# EAGLE design plantSensor (EAGLE 6.4)
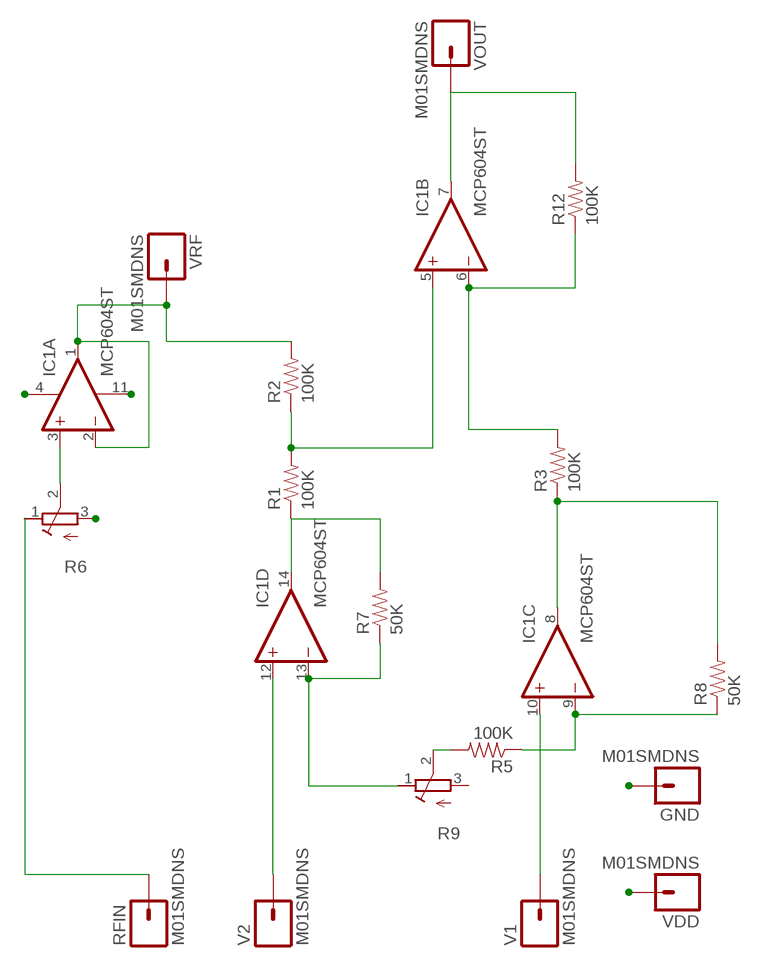
[diagram p0: schematic, sheet 1]

## Parts
GND  M01SMDNS  [1X01NS]
IC1  MCP604ST  [TSSOP14]
R1  100K  RESISTOR  [0805]
R2  100K  RESISTOR  [0805]
R3  100K  RESISTOR  [0805]
R5  100K  RESISTOR  [0805]
R6  R-TRIMM3314G  [RTRIM3314G]
R7  50K  RESISTOR  [0805]
R8  50K  RESISTOR  [0805]
R9  R-TRIMM3314G  [RTRIM3314G]
R12  100K  RESISTOR  [0805]
RFIN  M01SMDNS  [1X01NS]
V1  M01SMDNS  [1X01NS]
V2  M01SMDNS  [1X01NS]
VDD  M01SMDNS  [1X01NS]
VOUT  M01SMDNS  [1X01NS]
VRF  M01SMDNS  [1X01NS]

## Nets
GND: GND.1 IC1.11(P:V-) R6.3(A)
N$1: IC1.10(C:+IN) V1.1
N$2: R5.2 R9.2(S)
N$3: IC1.13(D:-IN) R7.1 R9.1(E)
N$4: IC1.12(D:+IN) V2.1
N$5: R6.1(E) RFIN.1
N$6: IC1.3(A:+IN) R6.2(S)
N$7: IC1.5(B:+IN) R1.2 R2.1
N$92: IC1.9(C:-IN) R5.1 R8.1
N$93: IC1.8(C:OUT) R3.1 R8.2
N$96: IC1.14(D:OUT) R1.1 R7.2
N$100: IC1.6(B:-IN) R3.2 R12.1
N$102: IC1.7(B:OUT) R12.2 VOUT.1
VDD: IC1.4(P:V+) VDD.1
VRF: IC1.1(A:OUT) IC1.2(A:-IN) R2.2 VRF.1
Unconnected: R9.3(A)

## Library data of the parts
GND RFIN V1 V2 VDD VOUT VRF = SparkFun-Connectors:M01: Header 1 Standard 1-pin 0.1" header. Use with straight break away headers (SKU : PRT-00116), right angle break away headers (PRT-00553), swiss pins (PRT-00743), machine pins (PRT-00117), and female headers (PRT-00115).
IC1 = linear:MCP604: Quad Op Amp 2.7V to 6.0V Single Supply CMOS Source: http://ww1.microchip.com/downloads/en/DeviceDoc/21314g.pdf
R1-R3 R5 R7 R8 R12 = SparkFun:RESISTOR: Resistor Basic schematic elements and footprints for 0603, 1206, and PTH 1/10th watt (small) resistors.
R6 R9 = rcl:R-TRIMM: Trimm resistor

## Board
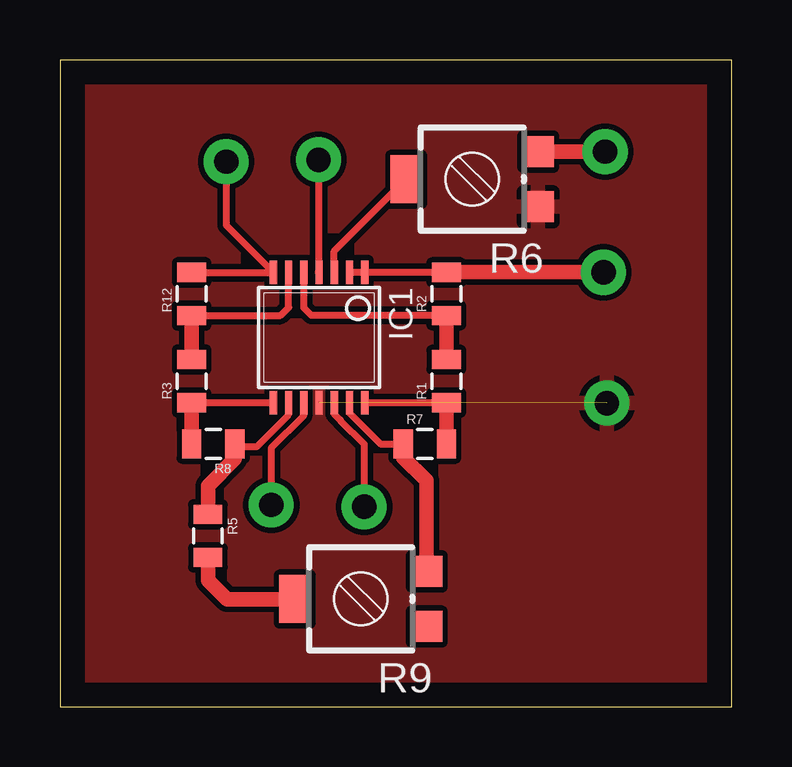
[diagram p1: board, top side]
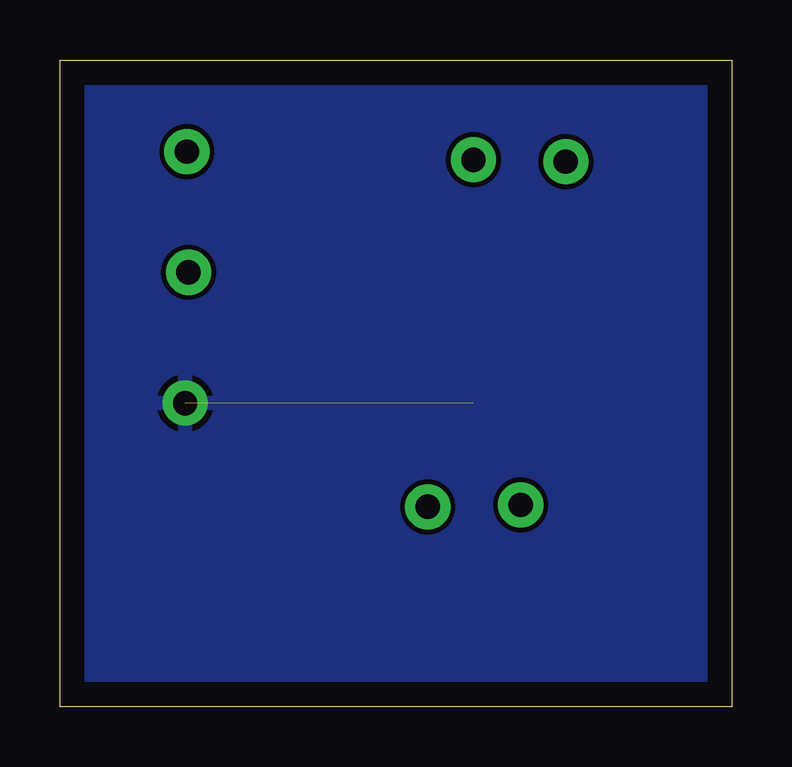
[diagram p2: board, bottom side, seen from below]

Size 28.02 x 26.97 mm. Coordinates in mm from the lower left corner, seen from the top.
Outline: 0,0 28.02,0.01 28.02,26.97 0.01,26.95 0,0
Copper layers (1*16): Top 0.035mm / dielectric 1.5mm / Bottom 0.035mm
Design rules "default": minimum track width 10mil, minimum drill 24mil, track to track 8mil, track to pad 8mil, pad to pad 8mil, via to via 8mil, smd to smd 8mil, copper to edge 40mil, drill to drill 8mil, minimum pad ring 10mil, minimum via ring 8mil, stop-mask expansion 4mil, vias tented up to drill 0mil, thermal gap 10mil

### Footprints (pad centres in the part's own frame; a part is rotated, then mirrored left to right if it is on the bottom)
1X01NS = drill 1.016 pad 1.88: 1 0,0
TSSOP14 = smd 0.305 x 0.991: 1 -1.905,-2.718; 2 -1.27,-2.718; 3 -0.635,-2.718; 4 0,-2.718; 5 0.635,-2.718; 6 1.27,-2.718; 7 1.905,-2.718; 8 1.905,2.718; 9 1.27,2.718; 10 0.635,2.718; 11 0,2.718; 12 -0.635,2.718; 13 -1.27,2.718; 14 -1.905,2.718
0805 = smd 0.8 x 1.2: 1 -0.9,0; 2 0.9,0
RTRIM3314G = smd 1.3 x 1.3: 1 1.15,-2.75; 3 -1.15,-2.75 | smd 2 x 1.3: 2 0,2.75

### Placement (x,y rotation side)
GND  22.8,12.65 0 top
IC1  10.8,15.4 180 top
R1  16.11,13.57 90 top
R2  16.11,17.22 90 top
R3  5.49,13.58 90 top
R5  6.17,7.12 270 top
R6  17.19,22 90 top
R7  15.21,10.96 0 top
R8  6.39,10.96 180 top
R9  12.54,4.49 90 top
R12  5.49,17.21 90 top
RFIN  22.73,23.14 0 top
V1  8.81,8.42 0 top
V2  12.69,8.33 0 top
VDD  10.78,22.8 0 top
VOUT  6.93,22.73 0 top
VRF  22.66,18.11 0 top

### Tracks (layer width: path | path; a pad name or v marks a point on that pad's centre or on a via)
GND  (1 unrouted)
  pour Top (isolate 0.23): -3.03,33.25 33.17,33.25 33.17,-2.25 -2.94,-2.25 -2.94,33.05 -2.84,33.05 -2.84,33.15
  pour Bottom: -8.08,35.83 39.8,35.83 39.8,-6.31 -8.08,-6.31 -8.08,35.52
N$1
  Top 0.3: IC1.10 10.15,12.24 10.15,12.12 8.81,10.78 V1.1
N$2
  Top 0.6: R5.2 6.17,5.28 6.96,4.49 R9.2
N$3
  Top 0.3: IC1.13 12.07,12.24 13.36,10.96 R7.1
  Top 0.305: 14.25,10.96 R7.1
  Top 0.6: R9.1 15.28,9.43 14.31,10.4 R7.1
N$4
  Top 0.3: IC1.12 11.44,12.22 11.69,11.97 11.69,11.94 12.68,10.94 V2.1
N$5
  Top 0.6: R6.1 RFIN.1
N$6
  Top 0.3: IC1.3 11.44,19 R6.2
N$7
  Top 0.3: R2.1 10.48,16.31 10.18,16.62 10.18,18.1 IC1.5
  Top 0.6: R2.1 R1.2
N$92
  Top 0.3: IC1.9 9.51,12.15 8.2,10.83 7.29,10.83 R8.1
  Top 0.305: R8.1
  Top 0.6: R8.1 7.29,10.32 6.17,9.2 R5.1
N$93
  Top 0.3: R3.1 IC1.8
  Top 0.305: IC1.8
  Top 0.6: R3.1 R8.2
N$96
  Top 0.3: R1.1 IC1.14
  Top 0.305: IC1.14
  Top 0.6: R1.1 R7.2
N$100
  Top 0.3: R12.1 9.2,16.31 9.54,16.65 IC1.6
  Top 0.6: R12.1 R3.2
N$102
  Top 0.3: R12.2 IC1.7 | VOUT.1 6.93,20.08 IC1.7
  Top 0.305: IC1.7
VDD
  Top 0.3: VDD.1 10.78,18.13 IC1.4
  Top 0.305: IC1.4
VRF
  Top 0.3: R2.2 IC1.1 IC1.2
  Top 0.305: 16.05,18.11 R2.2
  Top 0.6: R2.2 VRF.1